# Altium project Power Board UCC28951.PrjPcb (part 2 of 4)

## Sheet 5V_Isolated_Bias.SchDoc
size B
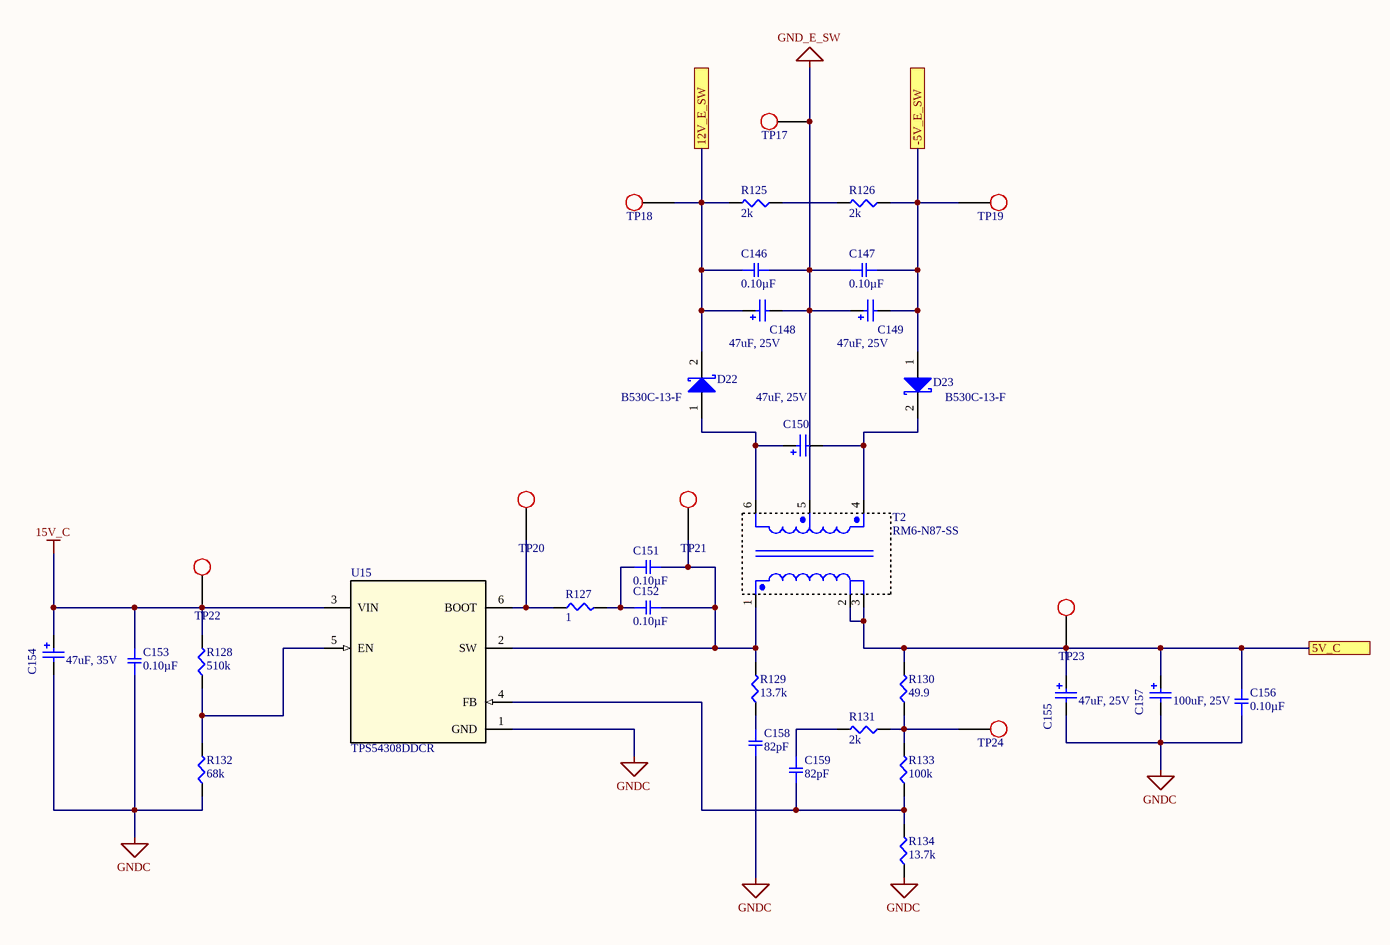
[diagram p7: 5V_Isolated_Bias.SchDoc]

### Parts
(Parts that share a designator on the sheet are numbered #1, #2 ... from top to bottom, then left to right.)
C146#1  0.10µF  [SMD-0603C]
C147#1  0.10µF  [SMD-0603C]
C148#1  47uF, 25V  [WCAP-ASLL_6.3x5.5]
C149#1  47uF, 25V  [WCAP-ASLL_6.3x5.5]
C150#1  47uF, 25V  [WCAP-ASLL_6.3x5.5]
C151#1  0.10µF  [SMD-0805C]
C152#1  0.10µF  [SMD-0805C]
C153#1  0.10µF  [SMD-0805C]
C154#1  47uF, 35V  [WCAP-ASLL_6.3x5.5]
C155  47uF, 25V  [WCAP-ASLL_6.3x5.5]
C156  0.10µF  [SMD-0603C]
C157  100uF, 25V  [WCAP-ASLU_8x6.5]
C158  82pF  [SMD-0805C]
C159  82pF  [SMD-0805C]
D22  B530C-13-F  [DIOD-SMC-2_V]
D23  B530C-13-F  [DIOD-SMC-2_V]
R125  2k  [SMD-0603-RES]
R126  2k  [SMD-0603-RES]
R127#1  1  [SMD-0603-RES]
R128#1  510k  [SMD-0603-RES]
R129#1  13.7k  [SMD-0603-RES]
R130#1  49.9  [SMD-0603-RES]
R131#1  2k  [SMD-0603-RES]
R132#1  68k  [SMD-0603-RES]
R133#1  100k  [SMD-0603-RES]
R134#1  13.7k  [SMD-0603-RES]
T2  RM6-N87-SS  [RM6-N87-SS]
TP17  Test Point  [Test_point_THT]  (value not drawn)  (no BOM)
TP18  Test Point  [Test_point_THT]  (value not drawn)  (no BOM)
TP19  Test Point  [Test_point_THT]  (value not drawn)  (no BOM)
TP20  Test Point  [Test_point_THT]  (value not drawn)  (no BOM)
TP21  Test Point  [Test_point_THT]  (value not drawn)  (no BOM)
TP22  Test Point  [Test_point_THT]  (value not drawn)  (no BOM)
TP23  Test Point  [Test_point_THT]  (value not drawn)  (no BOM)
TP24  Test Point  [Test_point_THT]  (value not drawn)  (no BOM)
U15#1  TPS54308DDCR  [SOT95P278X110-6N]

### Ports
5V_C, 12V_E_SW, -5V_E_SW

### Nets
5V_C: C155.2(P) C156.2 C157.2(P) R130#1.2 T2.2 T2.3 TP23.1 ; port 5V_C
12V_E_SW: C146#1.1 C148#1.2(P) D22.2(K) R125.2 TP18.1 ; port 12V_E_SW
15V_C: C153#1.2 C154#1.2(P) R128#1.2 TP22.1 U15#1.3(VIN)
-5V_E_SW: C147#1.2 C149#1.1(N) D23.1(A) R126.1 TP19.1 ; port -5V_E_SW
GND_E_SW: C146#1.2 C147#1.1 C148#1.1(N) C149#1.2(P) T2.5 TP17.1
GNDC: C153#1.1 C154#1.1(N) C155.1(N) C156.1 C157.1(N) C158.2 R132#1.1 R134#1.1 U15#1.1(GND)  [project net GND_LV]
NetC150#1_1: C150#1.1(N) D23.2(K) T2.4
NetC150#1_2: C150#1.2(P) D22.1(A) T2.6
NetC151#1_1: C151#1.1 C152#1.1 R127#1.2
NetC151#1_2: C151#1.2 C152#1.2 R129#1.2 T2.1 TP21.1 U15#1.2(SW)
NetC158_1: C158.1 R129#1.1
NetC159_1: C159.1 R131#1.2
NetC159_2: C159.2 R133#1.1 R134#1.2 U15#1.4(FB)
NetR125_1: R125.1 R126.2
NetR127#1_1: R127#1.1 TP20.1 U15#1.6(BOOT)
NetR128#1_1: R128#1.1 R132#1.2 U15#1.5(EN)
NetR130#1_1: R130#1.1 R131#1.1 R133#1.2 TP24.1

Not connected (* = marked no-connect by the designer): T2 8

### Library data of the parts
C146#1 C147#1 C156 = GCM188R71C104KA37D: CAP CER 0.1UF 16V X7R 0603; Manufacturer: Murata Electronics North America; Factory Stock: 0; Unit Price (USD): 0.18; Minimum Quantity: 1; Tolerance: ±10%; Datasheets: http://www.murata.com/~/media/webrenewal/support/library/catalog/products/capacitor/mlcc/c03e.ashx; Image: //media.digikey.com/Renders/Murata%20Renders/0603%28GCM188%29.jpg; Digi-Key Part Number: 490-4774-1-ND; Part Number: GCM188R71C104KA37D; Quantity Available: 284085; @ qty: 0; Packaging: Cut Tape (CT); Series: GCM; Part Status: Active; Value: 0.10µF; Voltage: 16V; Temperature Coefficient: X7R; Operating Temperature: -55°C ~ 125°C; Features: -; Ratings: AEC-Q200; Applications: Automotive; Mounting Type: Surface Mount, MLCC; Package / Case: 0603 (1608 Metric); Size / Dimension: 0.063" L x 0.031" W (1.60mm x 0.80mm); Height - Seated (Max): -; Thickness (Max): 0.035" (0.90mm); Lead Spacing: -; Lead Style: -
C148#1 C149#1 C150#1 C155 = 865060443004: WCAP-ASLL SMT Aluminum Electrolytic Capacitors, D6.3mm x L5.5mm, 47uF, +/-20%, 25VDC; Dissipation Factor: 14%; Endurance: 2000h; Leakage Current: 11.75uA; Ripple Current max.: 230mA; Technical Reference: ASED055470M025DVCTBB000; ComponentLink1Description: Manufacturer; ComponentLink1URL: http://www.we-online.de; ComponentLink2Description: Datasheet; ComponentLink2URL: https://katalog.we-online.com/pbs/datasheet/865060443004.pdf; Length: 5.5mm; Mounting Technology: SMT; Operating Temperature: -55 to +105degC; Packaging: Tape and Reel; Published Date: August 2019; Capacitance: 47uF; Diameter: 6.3mm; Part Number: 865060443004; Publisher: Wurth Elektronik; Capacitance Tolerance: +/-20%; Rated Voltage: 25VDC
C151#1 C152#1 C153#1 = GCD21BR71H104KA01L: CAP CER 0.1UF 50V X7R 0805; Manufacturer: Murata Electronics North America; Factory Stock: 0; Unit Price (USD): 0.24; Minimum Quantity: 1; Tolerance: ±10%; Datasheets: http://www.murata.com/~/media/webrenewal/support/library/catalog/products/capacitor/mlcc/c03e.ashx; Image: //media.digikey.com/Renders/Murata%20Renders/0805%28GxM6%29.jpg; Digi-Key Part Number: 490-11955-1-ND; Part Number: GCD21BR71H104KA01L; Quantity Available: 157; @ qty: 0; Packaging: Cut Tape (CT); Series: GCD; Part Status: Active; Value: 0.10µF; Voltage: 50V; Temperature Coefficient: X7R; Operating Temperature: -55°C ~ 125°C; Features: -; Ratings: AEC-Q200; Applications: Automotive; Mounting Type: Surface Mount, MLCC; Package / Case: 0805 (2012 Metric); Size / Dimension: 0.079" L x 0.049" W (2.00mm x 1.25mm); Height - Seated (Max): -; Thickness (Max): 0.049" (1.25mm); Lead Spacing: -; Lead Style: -
C154#1 = 865060543005: WCAP-ASLL SMT Aluminum Electrolytic Capacitors, D6.3mm x L5.5mm, 47uF, +/-20%, 35VDC; Dissipation Factor: 14%; Endurance: 2000h; Leakage Current: 16.45uA; Ripple Current max.: 240mA; Technical Reference: ASED055470M035DVCTBB000; ComponentLink1Description: Manufacturer; ComponentLink1URL: http://www.we-online.de; ComponentLink2Description: Datasheet; ComponentLink2URL: https://katalog.we-online.com/pbs/datasheet/865060543005.pdf; Length: 5.5mm; Mounting Technology: SMT; Operating Temperature: -55 to +105degC; Packaging: Tape and Reel; Published Date: August 2019; Capacitance: 47uF; Diameter: 6.3mm; Part Number: 865060543005; Publisher: Wurth Elektronik; Capacitance Tolerance: +/-20%; Rated Voltage: 35VDC
C157 = 865090449009: WCAP-ASLU Aluminium Electrolytic Capacitors, D8mm x L6.5mm, 100uF, +/-20%, 25VDC; Dissipation Factor: 16%; Leakage Current: 5uA; Endurance: 1000h; Technical Reference: ASBE065101M025DVCTBA000; Ripple Current max.: 110mA; ComponentLink1Description: Manufacturer; ComponentLink1URL: http://www.we-online.de; ComponentLink2Description: Datasheet; ComponentLink2URL: https://katalog.we-online.com/pbs/datasheet/865090449009.pdf; Mounting Technology: SMD; Operating Temperature: -40 to +85degC; Packaging: Tape and Reel; Part Number: 865090449009; Publisher: Wurth Elektronik; Capacitance: 100uF; Diameter: 8mm; Length: 6.5mm; Published Date: August 2019; Rated Voltage: 25VDC; Capacitance Tolerance: +/-20%
C158 C159 = GQM2195C1H820JB01D: CAP CER 82PF 50V NP0 0805; Manufacturer: Murata Electronics North America; Factory Stock: 0; Unit Price (USD): 1.22; Minimum Quantity: 1; Tolerance: ±5%; Temperature Coefficient: C0G, NP0; Datasheets: http://www.murata.com/~/media/webrenewal/support/library/catalog/products/capacitor/mlcc/c02e.pdf; Image: //media.digikey.com/Renders/Murata%20Renders/0805(GxM9).jpg; Digi-Key Part Number: 490-3615-1-ND; Part Number: GQM2195C1H820JB01D; Quantity Available: 7488; @ qty: 0; Packaging: Cut Tape (CT); Series: GQM; Part Status: Active; Value: 82pF; Voltage: 50V; Operating Temperature: -55°C ~ 125°C; Features: High Q, Low Loss; Ratings: -; Applications: RF, Microwave, High Frequency; Mounting Type: Surface Mount, MLCC; Package / Case: 0805 (2012 Metric); Size / Dimension: 0.079" L x 0.049" W (2.00mm x 1.25mm); Height - Seated (Max): -; Thickness (Max): 0.037" (0.95mm); Lead Spacing: -; Lead Style: -
D22 D23 = CMP-1693-00001-3: Surface Mount Schottky Barrier Rectifier, 5 A, 0.55 V, -55 to 150 degC, 2-Pin SMD, RoHS, Tape and Reel; Max Operating Temperature: 125 degC; ComponentLink2Description: Datasheet; PackageDescription: 2-Pin Surface Mount Device, Body 5.905 x 6.855 mm; Radiation Hardening: No; Mount: Surface Mount; Height: 2.3 mm; REACH SVHC: No SVHC; PartNumber: B530C-13-F; Packaging: Tape and Reel; Min Operating Temperature: -55 degC; Mounting Technology: Surface Mount; ComponentLink1URL: http://www.diodes.com/; ComponentLink1Description: Manufacturer URL; DatasheetVersion: Rev. 16-2; Length: 7.11 mm; ComponentLink2URL: http://www.diodes.com/_files/datasheets/ds13012.pdf; Package Quantity: 3000; Width: 6.22 mm; Case/Package: SMC; Pins: 2; RoHSCompliant: True
R125 R126 R131#1 = ERJ-3EKF2001V: RES SMD 2K OHM 1% 1/10W 0603; Manufacturer: Panasonic Electronic Components; Factory Stock: 0; Unit Price (USD): 0.00379; @ qty: 1500; Minimum Quantity: 1; Power (Watts): 0.1W, 1/10W; Temperature Coefficient: ±100ppm/°C; Part Number: ERJ-3EKF2001V; Datasheets: http://industrial.panasonic.com/www-cgi/jvcr13pz.cgi?E+PZ+3+AOA0002+ERJ3EKF2001V+7+WW; Image: //media.digikey.com/Photos/Panasonic%20Photos/MFG_ERJ-P6W%20Series.jpg; Digi-Key Part Number: P2.00KHCT-ND; Quantity Available: 1021544; Packaging: Cut Tape (CT); Series: ERJ; Part Status: Active; Value: 2k; Tolerance: ±1%; Composition: Thick Film; Features: Automotive AEC-Q200; Operating Temperature: -55°C ~ 155°C; Package / Case: 0603 (1608 Metric); Supplier Device Package: 0603; Size / Dimension: 0.063" L x 0.031" W (1.60mm x 0.80mm); Height - Seated (Max): 0.022" (0.55mm); Number of Terminations: 2; Failure Rate: -
R127#1 = ERJ-3BQF1R0V: RES SMD 1 OHM 1% 1/4W 0603; Manufacturer: Panasonic Electronic Components; Factory Stock: 0; Unit Price (USD): 0.05386; @ qty: 1500; Power (Watts): 0.25W, 1/4W; Temperature Coefficient: ±200ppm/°C; Part Number: ERJ-3BQF1R0V; Datasheets: https://industrial.panasonic.com/cdbs/www-data/pdf/RDA0000/AOA0000C239.pdf; Image: //media.digikey.com/Photos/Panasonic%20Photos/MFG_ERJ-P6W%20Series.jpg; Digi-Key Part Number: P17371CT-ND; Quantity Available: 30514; Minimum Quantity: 1; Packaging: Cut Tape (CT); Series: ERJ; Part Status: Active; Value: 1; Tolerance: ±1%; Composition: Thick Film; Features: Automotive AEC-Q200, Current Sense; Operating Temperature: -55°C ~ 125°C; Package / Case: 0603 (1608 Metric); Supplier Device Package: 0603; Size / Dimension: 0.063" L x 0.031" W (1.60mm x 0.80mm); Height - Seated (Max): 0.022" (0.55mm); Number of Terminations: 2; Failure Rate: -
R128#1 = ERJ-3EKF5103V: RES SMD 510K OHM 1% 1/10W 0603; Manufacturer: Panasonic Electronic Components; Factory Stock: 0; Unit Price (USD): 0.00379; @ qty: 1500; Minimum Quantity: 1; Power (Watts): 0.1W, 1/10W; Temperature Coefficient: ±100ppm/°C; Part Number: ERJ-3EKF5103V; Datasheets: http://industrial.panasonic.com/www-cgi/jvcr13pz.cgi?E+PZ+3+AOA0002+ERJ3EKF5103V+7+WW; Image: //media.digikey.com/Photos/Panasonic%20Photos/MFG_ERJ-P6W%20Series.jpg; Digi-Key Part Number: P510KHCT-ND; Quantity Available: 132059; Packaging: Cut Tape (CT); Series: ERJ; Part Status: Active; Value: 510k; Tolerance: ±1%; Composition: Thick Film; Features: Automotive AEC-Q200; Operating Temperature: -55°C ~ 155°C; Package / Case: 0603 (1608 Metric); Supplier Device Package: 0603; Size / Dimension: 0.063" L x 0.031" W (1.60mm x 0.80mm); Height - Seated (Max): 0.022" (0.55mm); Number of Terminations: 2; Failure Rate: -
R129#1 R134#1 = ERJ-3EKF1372V: RES SMD 13.7K OHM 1% 1/10W 0603; Manufacturer: Panasonic Electronic Components; Factory Stock: 0; Unit Price (USD): 0.00379; @ qty: 1500; Minimum Quantity: 1; Power (Watts): 0.1W, 1/10W; Temperature Coefficient: ±100ppm/°C; Part Number: ERJ-3EKF1372V; Datasheets: http://industrial.panasonic.com/www-cgi/jvcr13pz.cgi?E+PZ+3+AOA0002+ERJ3EKF1372V+7+WW; Image: //media.digikey.com/Photos/Panasonic%20Photos/MFG_ERJ-P6W%20Series.jpg; Digi-Key Part Number: P13.7KHCT-ND; Quantity Available: 81314; Packaging: Cut Tape (CT); Series: ERJ; Part Status: Active; Value: 13.7k; Tolerance: ±1%; Composition: Thick Film; Features: Automotive AEC-Q200; Operating Temperature: -55°C ~ 155°C; Package / Case: 0603 (1608 Metric); Supplier Device Package: 0603; Size / Dimension: 0.063" L x 0.031" W (1.60mm x 0.80mm); Height - Seated (Max): 0.022" (0.55mm); Number of Terminations: 2; Failure Rate: -
R130#1 = ERJ-3EKF49R9V: RES SMD 49.9 OHM 1% 1/10W 0603; Manufacturer: Panasonic Electronic Components; Factory Stock: 0; Unit Price (USD): 0.00379; @ qty: 1500; Minimum Quantity: 1; Power (Watts): 0.1W, 1/10W; Temperature Coefficient: ±100ppm/°C; Part Number: ERJ-3EKF49R9V; Datasheets: http://industrial.panasonic.com/www-cgi/jvcr13pz.cgi?E+PZ+3+AOA0002+ERJ3EKF49R9V+7+WW; Image: //media.digikey.com/Photos/Panasonic%20Photos/MFG_ERJ-P6W%20Series.jpg; Digi-Key Part Number: P49.9HCT-ND; Quantity Available: 566023; Packaging: Cut Tape (CT); Series: ERJ; Part Status: Active; Value: 49.9; Tolerance: ±1%; Composition: Thick Film; Features: Automotive AEC-Q200; Operating Temperature: -55°C ~ 155°C; Package / Case: 0603 (1608 Metric); Supplier Device Package: 0603; Size / Dimension: 0.063" L x 0.031" W (1.60mm x 0.80mm); Height - Seated (Max): 0.022" (0.55mm); Number of Terminations: 2; Failure Rate: -
R132#1 = ERJ-3EKF6802V: RES SMD 68K OHM 1% 1/10W 0603; Manufacturer: Panasonic Electronic Components; Factory Stock: 0; Unit Price (USD): 0.00379; @ qty: 1500; Minimum Quantity: 1; Power (Watts): 0.1W, 1/10W; Temperature Coefficient: ±100ppm/°C; Part Number: ERJ-3EKF6802V; Datasheets: http://industrial.panasonic.com/www-cgi/jvcr13pz.cgi?E+PZ+3+AOA0002+ERJ3EKF6802V+7+WW; Image: //media.digikey.com/Photos/Panasonic%20Photos/MFG_ERJ-P6W%20Series.jpg; Digi-Key Part Number: P68.0KHCT-ND; Quantity Available: 63788; Packaging: Cut Tape (CT); Series: ERJ; Part Status: Active; Value: 68k; Tolerance: ±1%; Composition: Thick Film; Features: Automotive AEC-Q200; Operating Temperature: -55°C ~ 155°C; Package / Case: 0603 (1608 Metric); Supplier Device Package: 0603; Size / Dimension: 0.063" L x 0.031" W (1.60mm x 0.80mm); Height - Seated (Max): 0.022" (0.55mm); Number of Terminations: 2; Failure Rate: -
R133#1 = ERJ-3GEYJ104V: RES SMD 100K OHM 5% 1/10W 0603; Manufacturer: Panasonic Electronic Components; Factory Stock: 0; Unit Price (USD): 0.00321; @ qty: 1500; Minimum Quantity: 1; Power (Watts): 0.1W, 1/10W; Temperature Coefficient: ±200ppm/°C; Part Number: ERJ-3GEYJ104V; Datasheets: http://industrial.panasonic.com/www-cgi/jvcr13pz.cgi?E+PZ+3+AOA0001+ERJ3GEYJ104V+7+WW; Image: //media.digikey.com/Photos/Panasonic%20Photos/MFG_ERJ-P6W%20Series.jpg; Digi-Key Part Number: P100KGCT-ND; Quantity Available: 1377078; Packaging: Cut Tape (CT); Series: ERJ; Part Status: Active; Value: 100k; Tolerance: ±5%; Composition: Thick Film; Features: Automotive AEC-Q200; Operating Temperature: -55°C ~ 155°C; Package / Case: 0603 (1608 Metric); Supplier Device Package: 0603; Size / Dimension: 0.063" L x 0.031" W (1.60mm x 0.80mm); Height - Seated (Max): 0.022" (0.55mm); Number of Terminations: 2; Failure Rate: -
TP17-TP24 = Test Point: TP
U15#1 = TPS54308DDCR: Imported; Manufacturer: Texas Instruments; PartNumber: TPS54308DDCR; RefDes: RefDes; Type: DEV; Value: Value; Manufacturer_Part_Number: TPS54308DDCR; Manufacturer_Name: Texas Instruments

## Sheet EMI Stage Break Out.SchDoc
size A4
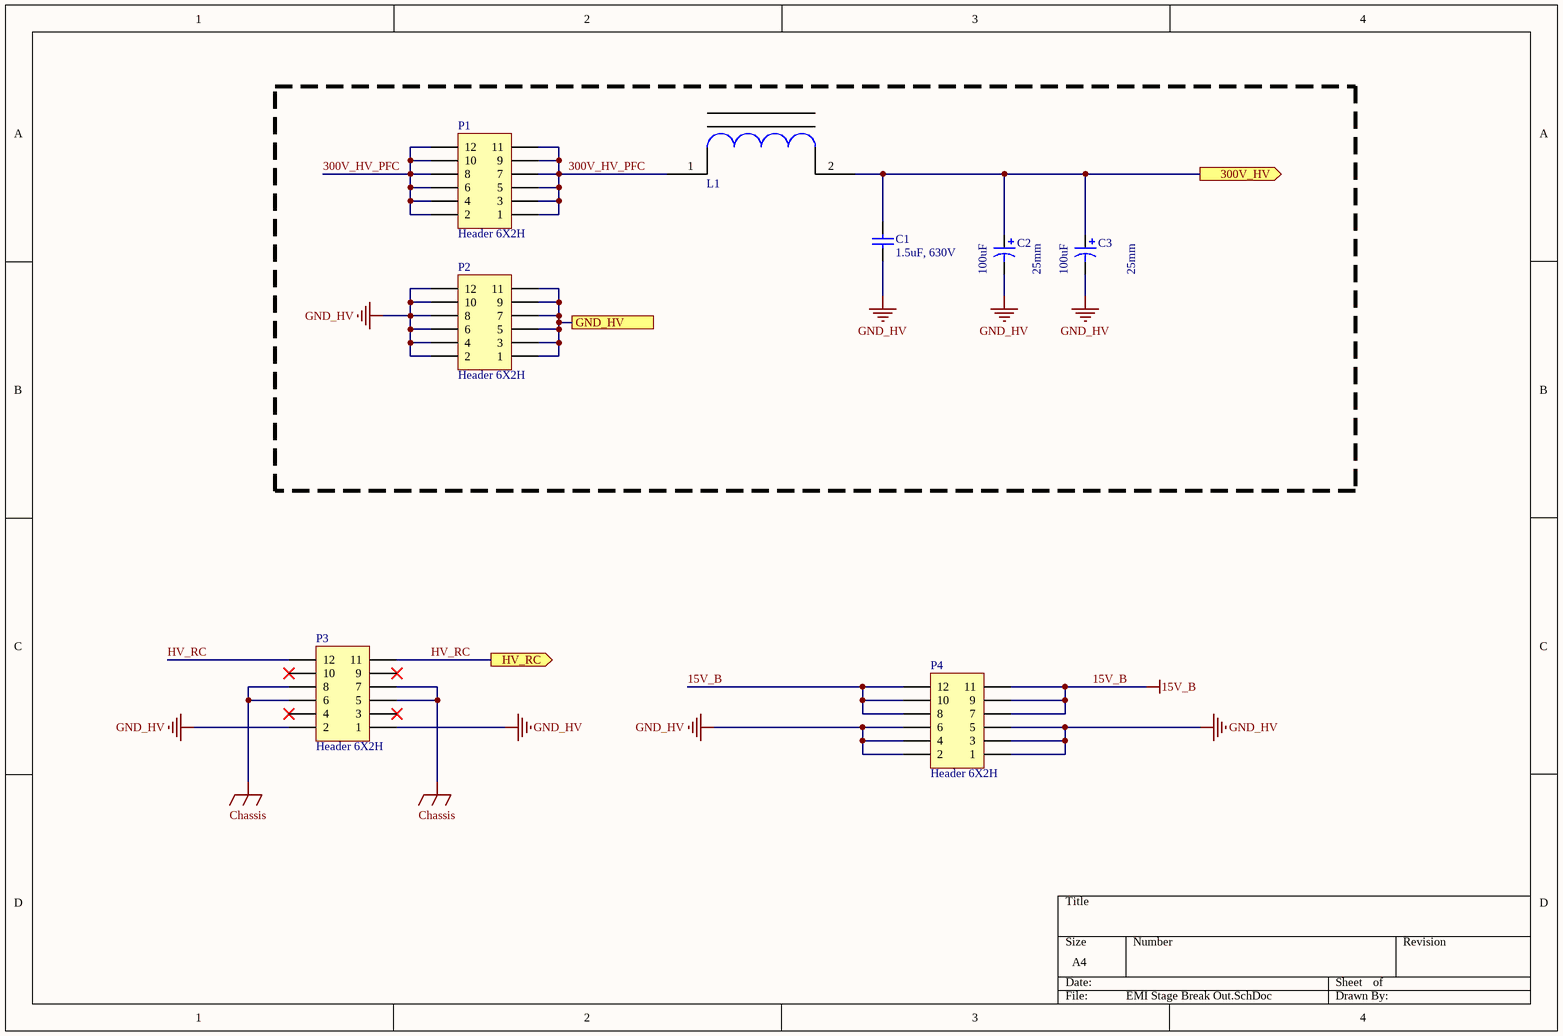
[diagram p8: EMI Stage Break Out.SchDoc]

### Parts
C1  1.5uF, 630V  [L31_W15_H24.5_P27.5]
C2  25mm  value 100uF  [450V_25mm_Dia_10mm_pitch - Black]
C3  25mm  value 100uF  [450V_25mm_Dia_10mm_pitch - Black]
L1  Transformer_Inductor  [Shim Inductor]  (value not drawn)
P1  Header 6X2H  [Stackable-Conn]
P2  Header 6X2H  [Stackable-Conn]
P3  Header 6X2H  [Stackable-Conn]
P4  Header 6X2H  [Stackable-Conn]

### Ports
300V_HV (out), GND_HV, HV_RC (out)

### Nets
15V_B: P4.7 P4.8 P4.9 P4.10 P4.11 P4.12
Chassis: P3.5 P3.6 P3.7 P3.8
GND_HV: C1.1 C2.2 C3.2 P2.1 P2.2 P2.3 P2.4 P2.5 P2.6 P2.7 P2.8 P2.9 P2.10 P2.11 P2.12 P3.1 P3.2 P4.1 P4.2 P4.3 P4.4 P4.5 P4.6 ; port GND_HV
300V_HV: C1.2 C2.1 C3.1 L1.2 ; port 300V_HV
300V_HV_PFC: L1.1 P1.1 P1.2 P1.3 P1.4 P1.5 P1.6 P1.7 P1.8 P1.9 P1.10 P1.11 P1.12
HV_RC: P3.11 P3.12 ; port HV_RC

Not connected (* = marked no-connect by the designer): P3 3* 4* 9* 10*

### Library data of the parts
C1 = 890303427009CS: WCAP-FTBE THT Film Capacitors, 1.5uF, 630VDC; Insulation Resistance: 3000Ohm x F; Dissipation Factor@100kHz: 5.2%; Dissipation Factor@1kHz: 1%; Dissipation Factor@10kHz: 1.6%; Pitch: 27.5mm; Rate of Voltage Rise: 17V/us; Technical Reference: MPSP275155K630DCPP25004; ComponentLink1Description: Manufacturer; ComponentLink1URL: http://www.we-online.de; ComponentLink2Description: Datasheet; ComponentLink2URL: https://katalog.we-online.com/pbs/datasheet/890303427009CS.pdf; Length: 31mm; Mounting Technology: THT; Packaging: Carton; Part Number: 890303427009CS; Operating Temperature: -40 to +85degC; Width: 15mm; Capacitance: 1.5uF; Height: 24.5mm; Rated Voltage: 630VDC; Publisher: Wurth Elektronik; Published Date: August 2019
C2 C3 = Cap Pol1: Polarized Capacitor (Radial); Published: 8-Jun-2000; LatestRevisionDate: 17-Jul-2002; LatestRevisionNote: Re-released for DXP Platform.; PackageReference: RB7.6-15; Publisher: Altium Limited; PackageDescription: Polarized Capacitor (Radial); 2 Leads
P1-P4 = Header 6X2H: Header, 6-Pin, Dual row, Right Angle; LatestRevisionDate: 17-Jul-2002; LatestRevisionNote: Re-released for DXP Platform.; Publisher: Altium Limited

## Sheet Thermal Sense Network.SchDoc
size C
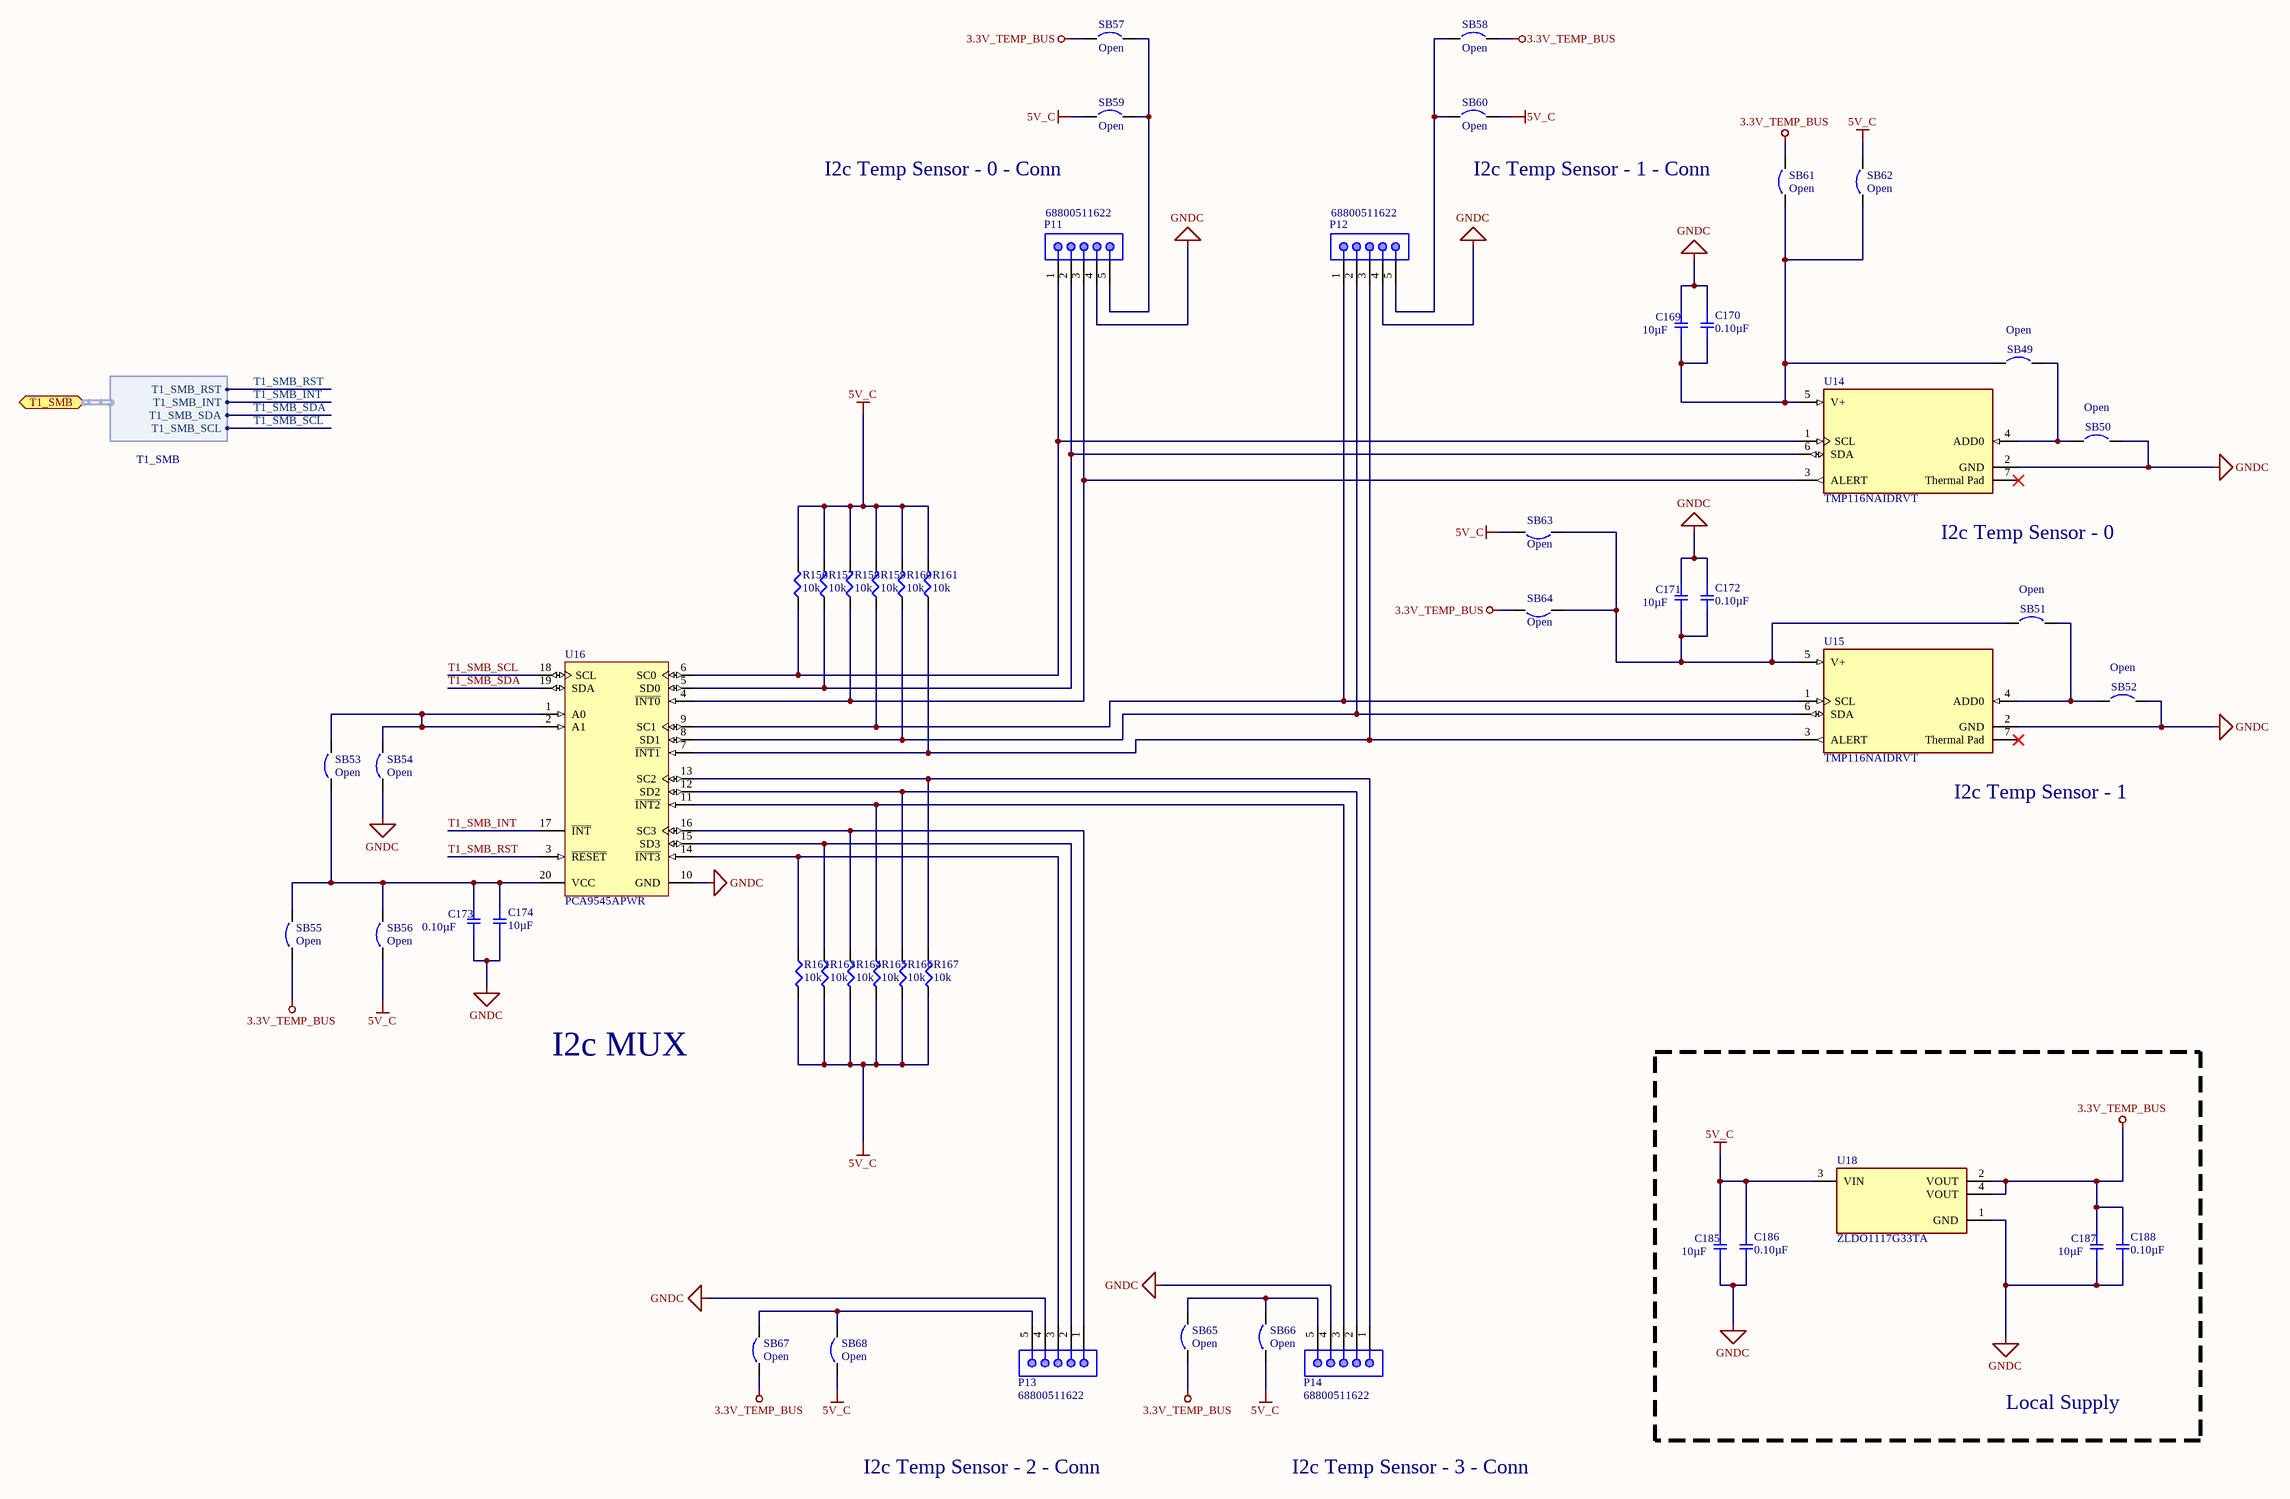
[diagram p9: Thermal Sense Network.SchDoc]

### Parts
(Parts that share a designator on the sheet are numbered #1, #2 ... from top to bottom, then left to right.)
C169  10µF  [SMD-0805C]
C170#1  0.10µF  [SMD-0805C]
C171#1  10µF  [SMD-0805C]
C172#1  0.10µF  [SMD-0805C]
C173#1  0.10µF  [SMD-0805C]
C174#1  10µF  [SMD-0805C]
C185  10µF  [SMD-0805C]
C186  0.10µF  [SMD-0805C]
C187  10µF  [SMD-0805C]
C188  0.10µF  [SMD-0805C]
P11  68800511622  [68800511622]
P12#2  68800511622  [68800511622]
P13#2  68800511622  [68800511622]
P14#1  68800511622  [68800511622]
R156#1  10k  [SMD-0603-RES]
R157#1  10k  [SMD-0603-RES]
R158#1  10k  [SMD-0603-RES]
R159#1  10k  [SMD-0603-RES]
R160#1  10k  [SMD-0603-RES]
R161#1  10k  [SMD-0603-RES]
R162#1  10k  [SMD-0603-RES]
R163#1  10k  [SMD-0603-RES]
R164  10k  [SMD-0603-RES]
R165  10k  [SMD-0603-RES]
R166  10k  [SMD-0603-RES]
R167  10k  [SMD-0603-RES]
SB49  Open  [SB_0603]  (no BOM)
SB50  Open  [SB_0603]  (no BOM)
SB51  Open  [SB_0603]  (no BOM)
SB52  Open  [SB_0603]  (no BOM)
SB53  Open  [SB_0603]  (no BOM)
SB54  Open  [SB_0603]  (no BOM)
SB55  Open  [SB_0603]  (no BOM)
SB56  Open  [SB_0603]  (no BOM)
SB57  Open  [1206 - Solder Bridge]  (no BOM)
SB58  Open  [1206 - Solder Bridge]  (no BOM)
SB59  Open  [1206 - Solder Bridge]  (no BOM)
SB60  Open  [1206 - Solder Bridge]  (no BOM)
SB61  Open  [0805-Solder Bridge]  (no BOM)
SB62  Open  [0805-Solder Bridge]  (no BOM)
SB63  Open  [0805-Solder Bridge]  (no BOM)
SB64  Open  [0805-Solder Bridge]  (no BOM)
SB65  Open  [1206 - Solder Bridge]  (no BOM)
SB66#1  Open  [1206 - Solder Bridge]  (no BOM)
SB67#1  Open  [1206 - Solder Bridge]  (no BOM)
SB68#1  Open  [1206 - Solder Bridge]  (no BOM)
U14#1  TMP116NAIDRVT  [FP-DRV0006A-MFG]
U15#2  TMP116NAIDRVT  [FP-DRV0006A-MFG]
U16  PCA9545APWR  [QFN50P350X450X80_HS-21N]
U18  ZLDO1117G33TA  [FP-SOT223-MFG]

### Blocks framed on the sheet
Local Supply: C185-C188 U18

### Ports
T1_SMB (bidir, harness T1_SMB)

### Harnesses
T1_SMB: T1_SMB_SCL, T1_SMB_SDA, T1_SMB_INT, T1_SMB_RST

### Nets
3.3V_TEMP_BUS: C187.1 C188.1 SB55.1 SB57.1 SB58.1 SB61.1 SB64.1 SB65.1 SB67#1.1 U18.2(VOUT) U18.4(VOUT)
5V_C: C185.1 C186.1 R156#1.2 R157#1.2 R158#1.2 R159#1.2 R160#1.2 R161#1.2 R162#1.2 R163#1.2 R164.2 R165.2 R166.2 R167.2 SB56.1 SB59.1 SB60.1 SB62.1 SB63.1 SB66#1.1 SB68#1.1 U18.3(VIN)
GNDC: C169.1 C170#1.1 C171#1.1 C172#1.1 C173#1.1 C174#1.1 C185.2 C186.2 C187.2 C188.2 P11.4 P12#2.4 P13#2.4 P14#1.4 SB50.2 SB52.2 SB54.1 U14#1.2(GND) U15#2.2(GND) U16.10(GND) U18.1(GND)  [project net GND_LV]
T1_SMB_INT: U16.17(~{INT}) ; port T1_SMB.T1_SMB_INT
T1_SMB_RST: U16.3(~{RESET}) ; port T1_SMB.T1_SMB_RST
T1_SMB_SCL: U16.18(SCL) ; port T1_SMB.T1_SMB_SCL
T1_SMB_SDA: U16.19(SDA) ; port T1_SMB.T1_SMB_SDA
NetC169_2: C169.2 C170#1.2 SB49.1 SB61.2 SB62.2 U14#1.5(V+)
NetC171#1_2: C171#1.2 C172#1.2 SB51.1 SB63.2 SB64.2 U15#2.5(V+)
NetC173#1_2: C173#1.2 C174#1.2 SB53.1 SB55.2 SB56.2 U16.20(VCC)
NetP11_1: P11.1 R156#1.1 U14#1.1(SCL) U16.6(SC0)
NetP11_2: P11.2 R157#1.1 U14#1.6(SDA) U16.5(SD0)
NetP11_3: P11.3 R158#1.1 U14#1.3(ALERT) U16.4(~{INT0})
NetP11_5: P11.5 SB57.2 SB59.2
NetP12#2_1: P12#2.1 R159#1.1 U15#2.1(SCL) U16.9(SC1)
NetP12#2_2: P12#2.2 R160#1.1 U15#2.6(SDA) U16.8(SD1)
NetP12#2_3: P12#2.3 R161#1.1 U15#2.3(ALERT) U16.7(~{INT1})
NetP12#2_5: P12#2.5 SB58.2 SB60.2
NetP13#2_1: P13#2.1 R164.1 U16.16(SC3)
NetP13#2_2: P13#2.2 R163#1.1 U16.15(SD3)
NetP13#2_3: P13#2.3 R162#1.1 U16.14(~{INT3})
NetP13#2_5: P13#2.5 SB67#1.2 SB68#1.2
NetP14#1_1: P14#1.1 R167.1 U16.13(SC2)
NetP14#1_2: P14#1.2 R166.1 U16.12(SD2)
NetP14#1_3: P14#1.3 R165.1 U16.11(~{INT2})
NetP14#1_5: P14#1.5 SB65.2 SB66#1.2
NetSB49_2: SB49.2 SB50.1 U14#1.4(ADD0)
NetSB51_2: SB51.2 SB52.1 U15#2.4(ADD0)
NetSB53_2: SB53.2 SB54.2 U16.1(A0) U16.2(A1)

Not connected (* = marked no-connect by the designer): U14#1 7(Thermal_Pad)*; U15#2 7(Thermal_Pad)*

### Notes on the sheet
- (near SB59) I2c Temp Sensor - 0 - Conn
- I2c Temp Sensor - 1 - Conn
- (near U14#1) I2c Temp Sensor - 0
- (near U15#2) I2c Temp Sensor - 1
- I2c MUX
- I2c Temp Sensor - 2 - Conn
- I2c Temp Sensor - 3 - Conn

### Library data of the parts
C169 C171#1 C174#1 C185 C187 = GRM21BC71E106ME11L: CAP CER 10UF 25V X7S 0805; Manufacturer: Murata Electronics North America; Factory Stock: 0; Unit Price (USD): 0.57; Minimum Quantity: 1; Tolerance: ±20%; Datasheets: http://www.murata.com/~/media/webrenewal/support/library/catalog/products/capacitor/mlcc/c02e.pdf; Image: //media.digikey.com/Renders/Murata%20Renders/0805%20(2012%20Metric)%20.85mm.jpg; Digi-Key Part Number: 490-10497-1-ND; Part Number: GRM21BC71E106ME11L; Quantity Available: 8540; @ qty: 0; Packaging: Cut Tape (CT); Series: GRM; Part Status: Active; Value: 10µF; Voltage: 25V; Temperature Coefficient: X7S; Operating Temperature: -55°C ~ 125°C; Features: Derating Recommended; Ratings: -; Applications: General Purpose; Mounting Type: Surface Mount, MLCC; Package / Case: 0805 (2012 Metric); Size / Dimension: 0.079" L x 0.049" W (2.00mm x 1.25mm); Height - Seated (Max): -; Thickness (Max): 0.057" (1.45mm); Lead Spacing: -; Lead Style: -
C170#1 C172#1 C173#1 C186 C188 = GCD21BR71H104KA01L: as C151#1 on sheet 5V_Isolated_Bias; Datasheets: http://www.murata.com/~/media/webrenewal/support/library/catalog/products/capacitor/mlcc/c03e.ashx; Image: //media.digikey.com/Renders/Murata%20Renders/0805%28GxM6%29.jpg; Digi-Key Part Number: 490-11955-1-ND; Part Number: GCD21BR71H104KA01L; Quantity Available: 157; @ qty: 0; Packaging: Cut Tape (CT); Series: GCD; Part Status: Active; Value: 0.10µF; Voltage: 50V; Temperature Coefficient: X7R; Operating Temperature: -55°C ~ 125°C; Features: -; Ratings: AEC-Q200; Applications: Automotive; Mounting Type: Surface Mount, MLCC; Package / Case: 0805 (2012 Metric); Size / Dimension: 0.079" L x 0.049" W (2.00mm x 1.25mm); Height - Seated (Max): -; Thickness (Max): 0.049" (1.25mm); Lead Spacing: -; Lead Style: -
P11 P12#2 P13#2 P14#1 = 68800511622: WR-WTB “J” Type THT Vertical Male Shrouded Header, pitch 2.5mm, 5p; Pin Number: 5; Contact Resistance: 20mOhm; Rated Current: 3A; Withstanding Voltage: 800VAC; Working Voltage: 250VAC; ComponentLink1Description: Manufacturer; ComponentLink1URL: http://www.we-online.de; ComponentLink2Description: Datasheet; ComponentLink2URL: https://www.we-online.com/catalog/datasheet/68800511622.pdf; Pitch: 2.5mm; Published Date: January 2020; Publisher: Wurth Elektronik; Mounting Technology: THT; Packaging: Bag; Operating Temperature: -25 to +85degC; Part Number: 68800511622; Gender: Male; Type: Vertical
R156#1 R157#1 R158#1 R159#1 R160#1 R161#1 R162#1 R163#1 R164-R167 = ERJ-3GEYJ103V: RES SMD 10K OHM 5% 1/10W 0603; Manufacturer: Panasonic Electronic Components; Factory Stock: 0; Unit Price (USD): 0.00321; @ qty: 1500; Minimum Quantity: 1; Power (Watts): 0.1W, 1/10W; Temperature Coefficient: ±200ppm/°C; Part Number: ERJ-3GEYJ103V; Datasheets: http://industrial.panasonic.com/www-cgi/jvcr13pz.cgi?E+PZ+3+AOA0001+ERJ3GEYJ103V+7+WW; Image: //media.digikey.com/Photos/Panasonic%20Photos/MFG_ERJ-P6W%20Series.jpg; Digi-Key Part Number: P10KGCT-ND; Quantity Available: 7178118; Packaging: Cut Tape (CT); Series: ERJ; Part Status: Active; Value: 10k; Tolerance: ±5%; Composition: Thick Film; Features: Automotive AEC-Q200; Operating Temperature: -55°C ~ 155°C; Package / Case: 0603 (1608 Metric); Supplier Device Package: 0603; Size / Dimension: 0.063" L x 0.031" W (1.60mm x 0.80mm); Height - Seated (Max): 0.022" (0.55mm); Number of Terminations: 2; Failure Rate: -
SB49-SB65 SB66#1 SB67#1 SB68#1 = Solder Bridge: Circuit Breaker; Published: 24-Mar-1999; Revision: July-2002: Re-released for DXP Platform.; Publisher: Altium Limited
U14#1 U15#2 = CMP-04948-000020-1: SENSOR DIGITAL -55C-125C 6WSON; Manufacturer: Texas Instruments; Max Supply Voltage: 5.5V; Min Supply Voltage: 1.9V; Standoff Height: 0mm; Accuracy: 0.2%; Operating Supply Current: 3.5-135uA; Max Junction Temp: +150°C; Interface: I2C,SMBus; Resolution: 16bits; Temperature Range High: +125°C; Device Class L1: Sensors; Package: DRV0006A; Temperature Range Low: -55°C; Lead Free: Yes; Digikey Description: SENSOR DIGITAL -55C-125C 6WSON; RoHS: TRUE; Height: 0.8mm; Ambient Temperature Range High: +150°C; Temperature: -55°C to +125°C; ComponentLink2Description: Datasheet; Device Class L3: unset; Ambient Temperature Range Low: -55°C; Category: IC; Octopart: https://octopart.com/tmp116naidrvt-texas+instruments-82367759; Device Class L2: Temperature and Humidity Sensors; Manufacturer Part Number: TMP116NAIDRVT; ComponentLink2URL: http://www.ti.com/lit/ds/symlink/tmp116.pdf; Automotive: No
U16 = CMP-0314-00327-2: 4-Channel I2C and SMBus Multiplexer with Interrupt Logic and Reset Functions, 2.3 to 5.5 V, -40 to 85 degC, 20-pin TSSOP (PW), Green (RoHS & no Sb/Br); Manufacturer: Texas Instruments; Max Frequency(kHz): 400; Interrupt Output: Yes; Channel Width: 4; VCC(Max)(V): 5.5; Simultaneously Active Channels: 1 to 4; VCC(Min)(V): 2.3; tpd max(ns): 1; SubFamily: I2C Multiplexer, Switch; I2C Address: 1110 0xx; fSCLK(Max)(MHz): 400; Code_JEDEC: MO-153; 5V Tolerant I/O: Yes; Vcc range(V): 2.3 to 5.5; PackageReference: PW0020A; Mounting Technology: Surface Mount; Open Drain I/O Type: Yes; ComponentLink1URL: http://www.ti.com/general/docs/lit/getliterature.tsp?genericPartNumber=PCA9545A&fileType=pdf; ComponentLink1Description: Datasheet; PackageVersion: revG, Feb-2011; DatasheetVersion: SCPS147C; PartNumber: PCA9545APWR; Eco-Plan: Green (RoHS & no Sb/Br); Reset Input: Yes; PackageDescription: 20-Pin Plastic Thin Small Outline Package 6.5 x 4.4 mm Body ,0.65 mm Pitch
U18 = CMP-12756-000030-1: IC REG LINEAR 3.3V 1A SOT223-3; Dropout Voltage: 1.11V; Power Dissipation: 15W; Output Voltage Accuracy: 2%; Max Input Voltage: 18V; Output Type: Fixed; Number of Regulators: 1; Min Input Voltage: 2.7V; Min Current Limit: 1.1A; Quiescent Current: 10mA; Polarity: Positive; Length: 6.7mm; Min Operating Temperature: -40°C; Max Output Current: 1A; Min Output Voltage: 3.3V; Width: 3.7mm; Reference Voltage: 3.3V; Number of Pins: 3; Package Quantity: 1000; Tolerance: 2%; Max Operating Temperature: 125°C; Output Voltage: 3.3V; Accuracy: 2%; Case/Package: SOT-223; Lead Free: Lead Free; Radiation Hardening: No; Output Current: 1A; Number of Outputs: 1; Packaging: Tape and Reel; REACH SVHC: No SVHC; Max Power Dissipation: 15W; Height: 1.7mm; Mount: Surface Mount; Weight: 0.000282oz; Nominal Output Voltage: 3.3V

## Sheet Output Sense Network.SchDoc
size A4
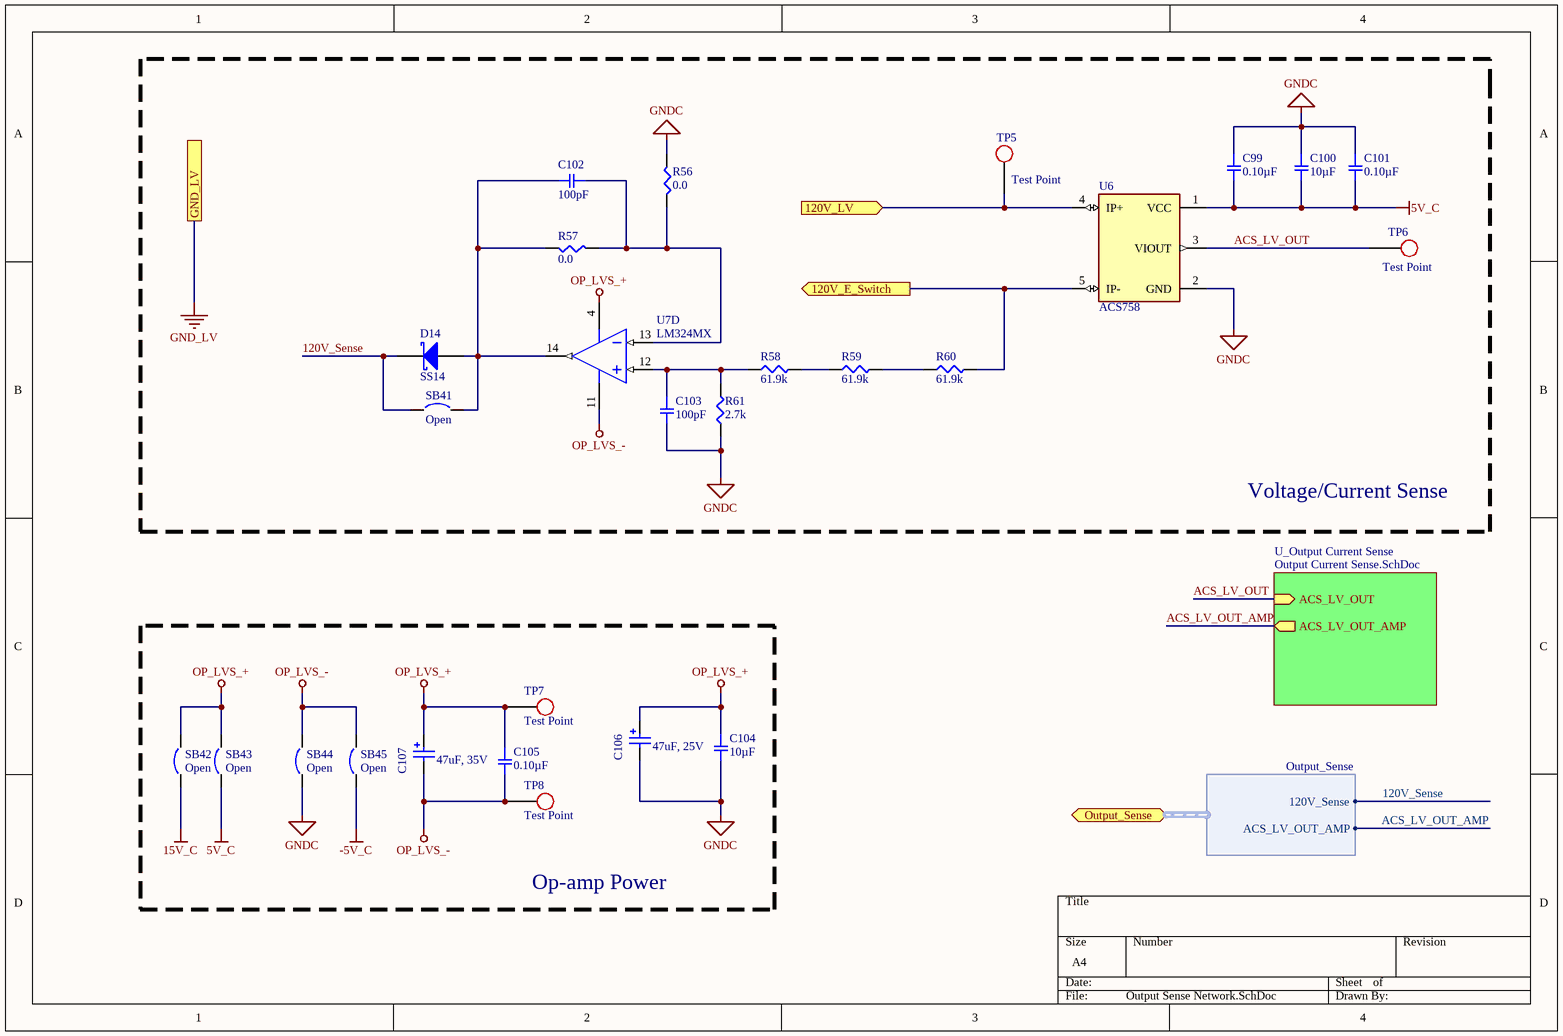
[diagram p10: Output Sense Network.SchDoc]

### Parts
(Parts that share a designator on the sheet are numbered #1, #2 ... from top to bottom, then left to right.)
C99  0.10µF  [SMD-0805C]
C100  10µF  [SMD-0805C]
C101  0.10µF  [SMD-0805C]
C102  100pF  [SMD-0603C]
C103#1  100pF  [SMD-0603C]
C104#1  10µF  [SMD-0805C]
C105#1  0.10µF  [SMD-0805C]
C106#1  47uF, 25V  [WCAP-ASLU_6.3x7.7]
C107#1  47uF, 35V  [WCAP-ASLL_6.3x5.5]
D14  SS14  [DIOM4226X22N]
R56  0.0  [SMD-0603-RES]
R57  0.0  [SMD-0603-RES]
R58  61.9k  [SMD-2512-RES]
R59  61.9k  [SMD-2512-RES]
R60  61.9k  [SMD-2512-RES]
R61  2.7k  [SMD-1206-RES]
SB41  Open  [0805-Solder Bridge]  (no BOM)
SB42  Open  [0805-Solder Bridge]  (no BOM)
SB43  Open  [0805-Solder Bridge]  (no BOM)
SB44  Open  [0805-Solder Bridge]  (no BOM)
SB45#1  Open  [0805-Solder Bridge]  (no BOM)
TP5  Test Point  [Test_point_SMD]  (no BOM)
TP6  Test Point  [Test_point_SMD]  (no BOM)
TP7  Test Point  [Test_point_SMD]  (no BOM)
TP8  Test Point  [Test_point_SMD]  (no BOM)
U6  ACS758  [XDCR_ACS758]
U7  LM324MX  [D0014A_L]  (part D of 4)

### Blocks framed on the sheet
Voltage/Current Sense: C99-C102 C103#1 D14 R56-R61 SB41 TP5 TP6 U6 U7
Op-amp Power: C104#1 C105#1 C106#1 C107#1 SB42-SB44 SB45#1 TP7 TP8

### Sub-sheets
U_Output Current Sense = Output Current Sense.SchDoc: ACS_LV_OUT (in), ACS_LV_OUT_AMP (out)

### Ports
120V_E_Switch (out), 120V_LV (in), GND_LV, Output_Sense (bidir, harness Output_Sense)

### Harnesses
Output_Sense: 120V_Sense, ACS_LV_OUT_AMP

### Nets
5V_C: C99.2 C100.2 C101.2 SB43.1 U6.1(VCC)
15V_C: SB42.1
-5V_C: SB45#1.1
GND_LV: C99.1 C100.1 C101.1 C103#1.2 C104#1.2 C106#1.1(N) R56.2 R61.1 SB44.1 U6.2(GND) ; port GND_LV  [also labelled GNDC]
OP_LVS_+: C104#1.1 C105#1.1 C106#1.2(P) C107#1.2(P) SB42.2 SB43.2 TP7.1 U7.4(V+)
OP_LVS_-: C105#1.2 C107#1.1(N) SB44.2 SB45#1.2 TP8.1 U7.11(GND)
120V_LV: TP5.1 U6.4(IP+) ; port 120V_LV
120V_Sense: D14.1(K) SB41.1 ; port Output_Sense.120V_Sense
ACS_LV_OUT: TP6.1 U6.3(VIOUT) ; sheet U_Output Current Sense/ACS_LV_OUT
ACS_LV_OUT_AMP: sheet U_Output Current Sense/ACS_LV_OUT_AMP, port Output_Sense.ACS_LV_OUT_AMP
E_SW_Clamp: R60.2 U6.5(IP-) ; port 120V_E_Switch
NetC102_1: C102.1 R56.1 R57.2 U7.13(IN4-)
NetC102_2: C102.2 D14.2(A) R57.1 SB41.2 U7.14(OUT4)
NetC103#1_1: C103#1.1 R58.1 R61.2 U7.12(IN4+)
NetR58_2: R58.2 R59.1
NetR59_2: R59.2 R60.1

### Library data of the parts
C99 C101 C105#1 = GCD21BR71H104KA01L: as C151#1 on sheet 5V_Isolated_Bias; Datasheets: http://www.murata.com/~/media/webrenewal/support/library/catalog/products/capacitor/mlcc/c03e.ashx; Image: //media.digikey.com/Renders/Murata%20Renders/0805%28GxM6%29.jpg; Digi-Key Part Number: 490-11955-1-ND; Part Number: GCD21BR71H104KA01L; Quantity Available: 157; @ qty: 0; Packaging: Cut Tape (CT); Series: GCD; Part Status: Active; Value: 0.10µF; Voltage: 50V; Temperature Coefficient: X7R; Operating Temperature: -55°C ~ 125°C; Features: -; Ratings: AEC-Q200; Applications: Automotive; Mounting Type: Surface Mount, MLCC; Package / Case: 0805 (2012 Metric); Size / Dimension: 0.079" L x 0.049" W (2.00mm x 1.25mm); Height - Seated (Max): -; Thickness (Max): 0.049" (1.25mm); Lead Spacing: -; Lead Style: -
C100 C104#1 = GCJ21BR71A106KE01L: CAP CER 10UF 10V X7R 0805; Manufacturer: Murata Electronics North America; Factory Stock: 0; Unit Price (USD): 0.56; Minimum Quantity: 1; Tolerance: ±10%; Datasheets: http://www.murata.com/~/media/webrenewal/support/library/catalog/products/capacitor/mlcc/c03e.ashx; Image: //media.digikey.com/Renders/Murata%20Renders/0805%20(2012%20Metric)%20.85mm.jpg; Digi-Key Part Number: 490-12646-1-ND; Part Number: GCJ21BR71A106KE01L; Quantity Available: 2702; @ qty: 0; Packaging: Cut Tape (CT); Series: GCJ; Part Status: Active; Value: 10µF; Voltage: 10V; Temperature Coefficient: X7R; Operating Temperature: -55°C ~ 125°C; Features: Soft Termination; Ratings: AEC-Q200; Applications: Automotive, Boardflex Sensitive; Mounting Type: Surface Mount, MLCC; Package / Case: 0805 (2012 Metric); Size / Dimension: 0.079" L x 0.049" W (2.00mm x 1.25mm); Height - Seated (Max): -; Thickness (Max): 0.057" (1.45mm); Lead Spacing: -; Lead Style: -
C102 C103#1 = GCM1885C1H101JA16D: CAP CER 100PF 50V NP0 0603; Manufacturer: Murata Electronics North America; Factory Stock: 0; Unit Price (USD): 0.1; Minimum Quantity: 1; Tolerance: ±5%; Temperature Coefficient: C0G, NP0; Datasheets: http://www.murata.com/~/media/webrenewal/support/library/catalog/products/capacitor/mlcc/c03e.ashx; Image: //media.digikey.com/Renders/Murata%20Renders/0603%28GCM188%29.jpg; Digi-Key Part Number: 490-4767-1-ND; Part Number: GCM1885C1H101JA16D; Quantity Available: 85695; @ qty: 0; Packaging: Cut Tape (CT); Series: GCM; Part Status: Active; Value: 100pF; Voltage: 50V; Operating Temperature: -55°C ~ 125°C; Features: -; Ratings: AEC-Q200; Applications: Automotive; Mounting Type: Surface Mount, MLCC; Package / Case: 0603 (1608 Metric); Size / Dimension: 0.063" L x 0.031" W (1.60mm x 0.80mm); Height - Seated (Max): -; Thickness (Max): 0.035" (0.90mm); Lead Spacing: -; Lead Style: -
C106#1 = 865090445006: WCAP-ASLU Aluminium Electrolytic Capacitors, D6.3mm x L7.7mm, 47uF, +/-20%, 25VDC; Dissipation Factor: 16%; Leakage Current: 2.35uA; Endurance: 1000h; Technical Reference: ASBD077470M025DVCTCA000; Ripple Current max.: 65mA; ComponentLink1Description: Manufacturer; ComponentLink1URL: http://www.we-online.de; ComponentLink2Description: Datasheet; ComponentLink2URL: https://katalog.we-online.com/pbs/datasheet/865090445006.pdf; Mounting Technology: SMD; Operating Temperature: -40 to +85degC; Packaging: Tape and Reel; Part Number: 865090445006; Publisher: Wurth Elektronik; Capacitance: 47uF; Diameter: 6.3mm; Length: 7.7mm; Published Date: August 2019; Rated Voltage: 25VDC; Capacitance Tolerance: +/-20%
C107#1 = 865060543005: as C154#1 on sheet 5V_Isolated_Bias; ComponentLink1Description: Manufacturer; ComponentLink1URL: http://www.we-online.de; ComponentLink2Description: Datasheet; ComponentLink2URL: https://katalog.we-online.com/pbs/datasheet/865060543005.pdf; Length: 5.5mm; Mounting Technology: SMT; Operating Temperature: -55 to +105degC; Packaging: Tape and Reel; Published Date: August 2019; Capacitance: 47uF; Diameter: 6.3mm; Part Number: 865060543005; Publisher: Wurth Elektronik; Capacitance Tolerance: +/-20%; Rated Voltage: 35VDC
D14 = SS14: Schottky Rectifier, 1.1 W, -65 to 125 degC, 2-Pin SMD, RoHS, Tape and Reel; Manufacturer: Fairchild; Configuration: SINGLE; Diode Element Material: SILICON; Power Dissipation Limit-Max (W): 1.1; Additional Feature: FREEWHEELINGDIODE; Signal Diode Type: SIGNALDIODE; Number of Elements: 1; JEDEC-95 Code: DO-214AC; Rep Pk Reverse Voltage-Max (V): 40; Package Body Material: PLASTIC/EPOXY; CAGE Code: 1HBD3,07933,59621,7D893; Peak Reflow Temperature (Cel): 260; Package Shape: RECTANGULAR; Manufacturer URL: https://www.fairchildsemi.com/; JESD-97 Code: e3; Package Reference: DO-214AC-2; RoHS Compliant: YES; Package Description: 2-Pin Surface Mount Device, Body 4.375 x 2.725 mm; Technology: SCHOTTKY; Surface Mount: YES; Datasheet URL: http://www.onlinecomponents.com/datasheet/ss14.aspx?p=11369800; Terminal Form: CBEND; Package Style: SMALLOUTLINE; Number of Terminals: 2; JESD-30 Code: R-PDSO-C2; Average Forward Current-Max (A): 1; Terminal Finish: MATTETIN; Datasheet Version: Oct-13; Terminal Position: DUAL; Package URL: https://www.fairchildsemi.com/package-drawings/DO/DO214AC.pdf; Moisture Sensitivity Level: 1; Lead Free: YES
R56 R57 = ERJ-3GEY0R00V: RES SMD 0.0OHM JUMPER 1/10W 0603; Manufacturer: Panasonic Electronic Components; Factory Stock: 0; Unit Price (USD): 0.00352; @ qty: 1500; Minimum Quantity: 1; Power (Watts): 0.1W, 1/10W; Part Number: ERJ-3GEY0R00V; Datasheets: http://industrial.panasonic.com/www-cgi/jvcr13pz.cgi?E+PZ+3+AOA0001+ERJ3GEY0R00V+7+WW; Image: //media.digikey.com/Photos/Panasonic%20Photos/MFG_ERJ-P6W%20Series.jpg; Digi-Key Part Number: P0.0GCT-ND; Quantity Available: 4813372; Packaging: Cut Tape (CT); Series: ERJ; Part Status: Active; Value: 0.0; Tolerance: Jumper; Composition: Thick Film; Features: Automotive AEC-Q200; Temperature Coefficient: -; Operating Temperature: -55°C ~ 155°C; Package / Case: 0603 (1608 Metric); Supplier Device Package: 0603; Size / Dimension: 0.063" L x 0.031" W (1.60mm x 0.80mm); Height - Seated (Max): 0.022" (0.55mm); Number of Terminations: 2; Failure Rate: -
R58-R60 = ERJ-1TNF6192U: RES SMD 61.9K OHM 1% 1W 2512; Manufacturer: Panasonic Electronic Components; Factory Stock: 0; Unit Price (USD): 0.14799; @ qty: 1500; Minimum Quantity: 1; Temperature Coefficient: ±100ppm/°C; Part Number: ERJ-1TNF6192U; Datasheets: http://industrial.panasonic.com/www-cgi/jvcr13pz.cgi?E+PZ+3+AOA0002+ERJ1TNF6192U+7+WW; Image: //media.digikey.com/Renders/Panasonic%20Renders/ERJ-2512%20Pkg.jpg; Digi-Key Part Number: PT61.9KAFCT-ND; Quantity Available: 2628; Packaging: Cut Tape (CT); Series: ERJ; Part Status: Active; Value: 61.9k; Tolerance: ±1%; Power (Watts): 1W; Composition: Thick Film; Features: Automotive AEC-Q200; Operating Temperature: -55°C ~ 155°C; Package / Case: 2512 (6432 Metric); Supplier Device Package: 2512; Size / Dimension: 0.252" L x 0.126" W (6.40mm x 3.20mm); Height - Seated (Max): 0.028" (0.70mm); Number of Terminations: 2; Failure Rate: -
R61 = ERJ-8ENF2701V: RES SMD 2.7K OHM 1% 1/4W 1206; Manufacturer: Panasonic Electronic Components; Factory Stock: 0; Unit Price (USD): 0.00933; @ qty: 1500; Minimum Quantity: 1; Power (Watts): 0.25W, 1/4W; Temperature Coefficient: ±100ppm/°C; Part Number: ERJ-8ENF2701V; Datasheets: http://industrial.panasonic.com/www-cgi/jvcr13pz.cgi?E+PZ+3+AOA0002+ERJ8ENF2701V+7+WW; Image: //media.digikey.com/Renders/Panasonic%20Renders/ERJ-1206%20Pkg.jpg; Digi-Key Part Number: P2.70KFCT-ND; Quantity Available: 47214; Packaging: Cut Tape (CT); Series: ERJ; Part Status: Active; Value: 2.7k; Tolerance: ±1%; Composition: Thick Film; Features: Automotive AEC-Q200; Operating Temperature: -55°C ~ 155°C; Package / Case: 1206 (3216 Metric); Supplier Device Package: 1206; Size / Dimension: 0.126" L x 0.063" W (3.20mm x 1.60mm); Height - Seated (Max): 0.028" (0.70mm); Number of Terminations: 2; Failure Rate: -
SB41-SB44 SB45#1 = Solder Bridge: Circuit Breaker; Published: 24-Mar-1999; Revision: July-2002: Re-released for DXP Platform.; Publisher: Altium Limited
U6 = ACS758: Current Sensor 50A 1 Channel Hall Effect, Open Loop Unidirectional 5-CB Formed Leads, PFF; MF: Allegro MicroSystems LLC; Package: 5-CB-5 Allegro MicroSystems LLC; MP: ACS758; Availability: Unavailable; Price: None; Value: *; SnapEDA_Link: https://www.snapeda.com/parts/ACS758/Allegro%20MicroSystems%20LLC/view-part/226237/?ref=snap
U7 = CMP-0055-00741-3: Low Power Quad Operational Amplifier, 14-pin Narrow SOIC; Manufacturer: Texas Instruments; PowerWise: N; CompType: Amplifiers; PackageTopMarking: NSUZXYTTE#*LM324M; Package Reference: D0014A; ComponentLink1URL: http://www.ti.com/general/docs/lit/getliterature.tsp?genericPartNumber=LM324-N&fileType=pdf; PinCount: 14; PackageDescription: Molded Package S.O., .150in Wide, 14 Lead; Code_JEDEC: MS-012AB; Code_IPC: SOIC127P600-14; ComponentLink1Description: Datasheet URL; RoHS: N

## Sheet Output Current Sense.SchDoc
size A3
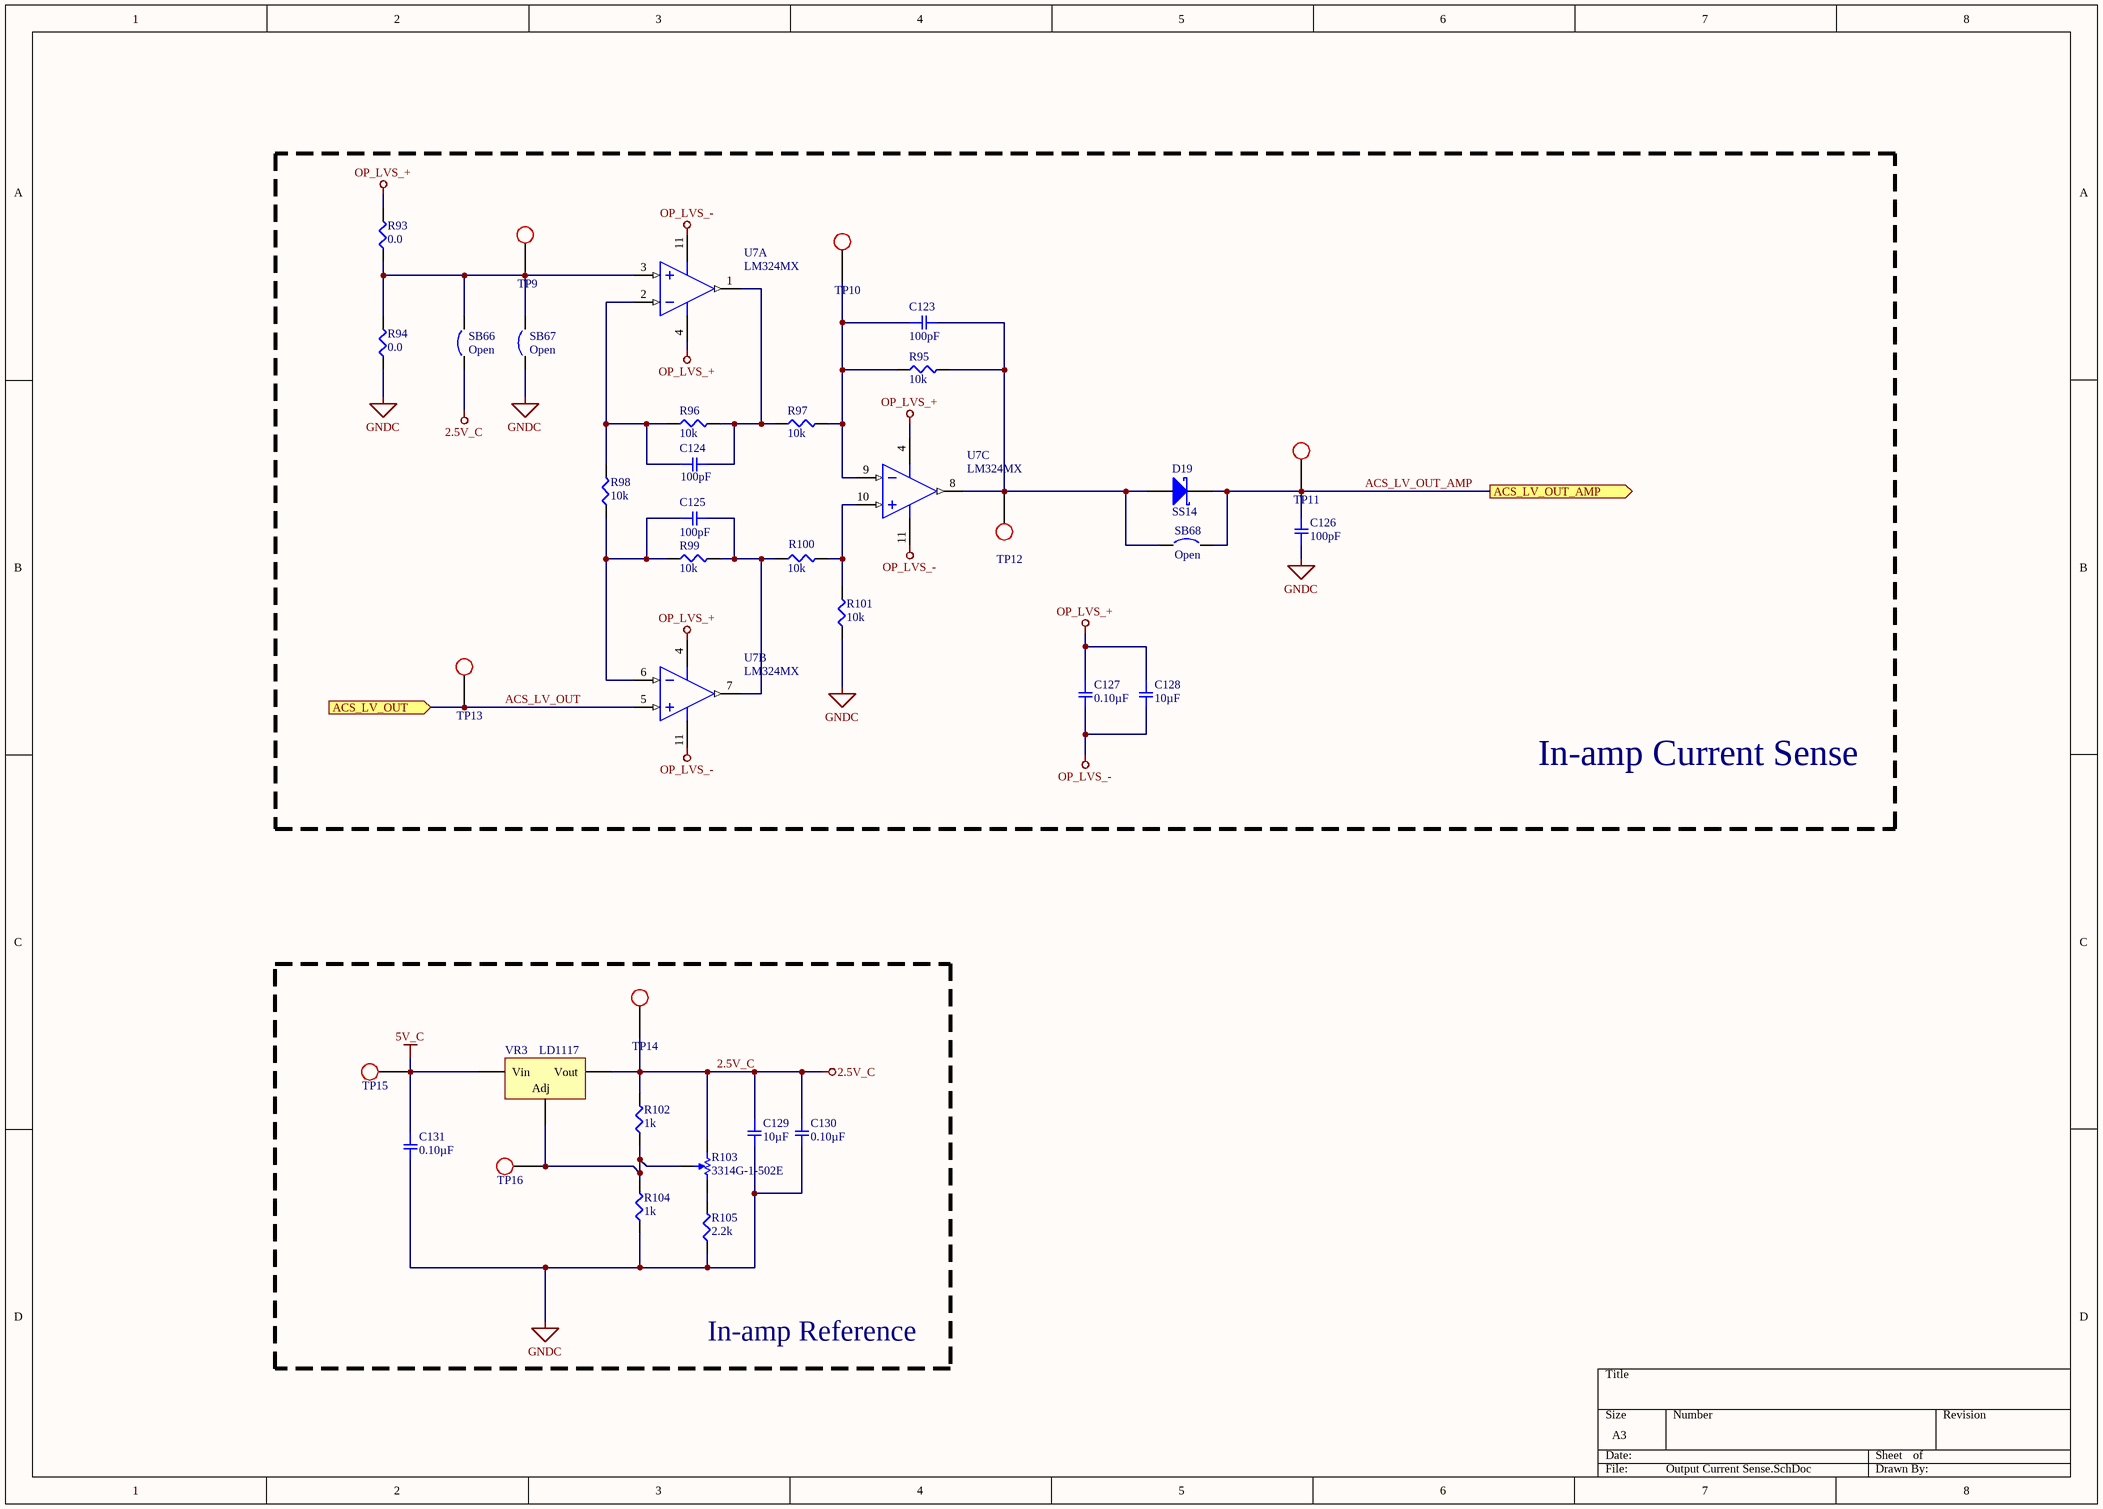
[diagram p11: Output Current Sense.SchDoc]

### Parts
(Parts that share a designator on the sheet are numbered #1, #2 ... from top to bottom, then left to right.)
C123  100pF  [SMD-0603C]
C124  100pF  [SMD-0603C]
C125  100pF  [SMD-0603C]
C126  100pF  [SMD-0603C]
C127  0.10µF  [SMD-0805C]
C128  10µF  [SMD-0805C]
C129  10µF  [SMD-0805C]
C130  0.10µF  [SMD-0805C]
C131  0.10µF  [SMD-0805C]
D19  SS14  [DIOM4226X22N]
R93  0.0  [SMD-0603-RES]
R94  0.0  [SMD-0603-RES]
R95  10k  [SMD-0603-RES]
R96  10k  [SMD-0603-RES]
R97  10k  [SMD-0603-RES]
R98  10k  [SMD-0603-RES]
R99  10k  [SMD-0603-RES]
R100  10k  [SMD-0603-RES]
R101  10k  [SMD-0603-RES]
R102  1k  [SMD-0603-RES]
R103  3314G-1-502E  [BOUR-3314G-1_V]
R104  1k  [SMD-0603-RES]
R105  2.2k  [SMD-0603-RES]
SB66#2  Open  [0805-Solder Bridge]  (no BOM)
SB67#2  Open  [0805-Solder Bridge]  (no BOM)
SB68#2  Open  [0805-Solder Bridge]  (no BOM)
TP9  Test Point  [Test_point_THT]  (value not drawn)  (no BOM)
TP10  Test Point  [Test_point_THT]  (value not drawn)  (no BOM)
TP11  Test Point  [Test_point_THT]  (value not drawn)  (no BOM)
TP12  Test Point  [Test_point_THT]  (value not drawn)  (no BOM)
TP13  Test Point  [Test_point_THT]  (value not drawn)  (no BOM)
TP14  Test Point  [Test_point_THT]  (value not drawn)  (no BOM)
TP15  Test Point  [Test_point_THT]  (value not drawn)  (no BOM)
TP16  Test Point  [Test_point_THT]  (value not drawn)  (no BOM)
U7  LM324MX  [D0014A_L]  (parts A,B,C of 4)
VR3  LD1117  [SOT230P700X180-4N]

### Blocks framed on the sheet
In-amp Current Sense: C123-C128 D19 R93-R101 SB66#2 SB67#2 SB68#2 TP9-TP13 U7
In-amp Reference: C129-C131 R102-R105 TP14-TP16 VR3

### Ports
ACS_LV_OUT (in), ACS_LV_OUT_AMP (out)

### Nets
2.5V_C: C129.1 C130.1 R102.2 R103.1 SB66#2.1 TP14.1 VR3.2(Vout)
5V_C: C131.1 TP15.1 VR3.3(Vin)
GNDC: C126.1 C129.2 C130.2 C131.2 R94.1 R101.1 R104.1 R105.1 SB67#2.1  [project net GND_LV]
OP_LVS_+: C127.1 C128.1 R93.2 U7.4(V+)
OP_LVS_-: C127.2 C128.2 U7.11(GND)
ACS_LV_OUT: TP13.1 U7.5(IN2+) ; port ACS_LV_OUT
ACS_LV_OUT_AMP: C126.2 D19.1(K) SB68#2.2 TP11.1 ; port ACS_LV_OUT_AMP
NetC123_1: C123.1 R95.1 R97.2 TP10.1 U7.9(IN3-)
NetC123_2: C123.2 D19.2(A) R95.2 SB68#2.1 TP12.1 U7.8(OUT3)
NetC124_1: C124.1 R96.1 R98.2 U7.2(IN1-)
NetC124_2: C124.2 R96.2 R97.1 U7.1(OUT1)
NetC125_1: C125.1 R98.1 R99.1 U7.6(IN2-)
NetC125_2: C125.2 R99.2 R100.1 U7.7(OUT2)
NetR93_1: R93.1 R94.2 SB66#2.2 SB67#2.2 TP9.1 U7.3(IN1+)
NetR100_2: R100.2 R101.2 U7.10(IN3+)
NetR102_1: R102.1 R103.2 R104.2 TP16.1 VR3.1(Adj)
NetR103_3: R103.3 R105.2

### Library data of the parts
C123-C126 = GCM1885C1H101JA16D: as C102 on sheet Output Sense Network; Datasheets: http://www.murata.com/~/media/webrenewal/support/library/catalog/products/capacitor/mlcc/c03e.ashx; Image: //media.digikey.com/Renders/Murata%20Renders/0603%28GCM188%29.jpg; Digi-Key Part Number: 490-4767-1-ND; Part Number: GCM1885C1H101JA16D; Quantity Available: 85695; @ qty: 0; Packaging: Cut Tape (CT); Series: GCM; Part Status: Active; Value: 100pF; Voltage: 50V; Operating Temperature: -55°C ~ 125°C; Features: -; Ratings: AEC-Q200; Applications: Automotive; Mounting Type: Surface Mount, MLCC; Package / Case: 0603 (1608 Metric); Size / Dimension: 0.063" L x 0.031" W (1.60mm x 0.80mm); Height - Seated (Max): -; Thickness (Max): 0.035" (0.90mm); Lead Spacing: -; Lead Style: -
C127 C130 C131 = GCD21BR71H104KA01L: as C151#1 on sheet 5V_Isolated_Bias; Datasheets: http://www.murata.com/~/media/webrenewal/support/library/catalog/products/capacitor/mlcc/c03e.ashx; Image: //media.digikey.com/Renders/Murata%20Renders/0805%28GxM6%29.jpg; Digi-Key Part Number: 490-11955-1-ND; Part Number: GCD21BR71H104KA01L; Quantity Available: 157; @ qty: 0; Packaging: Cut Tape (CT); Series: GCD; Part Status: Active; Value: 0.10µF; Voltage: 50V; Temperature Coefficient: X7R; Operating Temperature: -55°C ~ 125°C; Features: -; Ratings: AEC-Q200; Applications: Automotive; Mounting Type: Surface Mount, MLCC; Package / Case: 0805 (2012 Metric); Size / Dimension: 0.079" L x 0.049" W (2.00mm x 1.25mm); Height - Seated (Max): -; Thickness (Max): 0.049" (1.25mm); Lead Spacing: -; Lead Style: -
C128 C129 = GCJ21BR71A106KE01L: as C100 on sheet Output Sense Network; Datasheets: http://www.murata.com/~/media/webrenewal/support/library/catalog/products/capacitor/mlcc/c03e.ashx; Image: //media.digikey.com/Renders/Murata%20Renders/0805%20(2012%20Metric)%20.85mm.jpg; Digi-Key Part Number: 490-12646-1-ND; Part Number: GCJ21BR71A106KE01L; Quantity Available: 2702; @ qty: 0; Packaging: Cut Tape (CT); Series: GCJ; Part Status: Active; Value: 10µF; Voltage: 10V; Temperature Coefficient: X7R; Operating Temperature: -55°C ~ 125°C; Features: Soft Termination; Ratings: AEC-Q200; Applications: Automotive, Boardflex Sensitive; Mounting Type: Surface Mount, MLCC; Package / Case: 0805 (2012 Metric); Size / Dimension: 0.079" L x 0.049" W (2.00mm x 1.25mm); Height - Seated (Max): -; Thickness (Max): 0.057" (1.45mm); Lead Spacing: -; Lead Style: -
D19 = SS14: as D14 on sheet Output Sense Network; Peak Reflow Temperature (Cel): 260; Package Shape: RECTANGULAR; Manufacturer URL: https://www.fairchildsemi.com/; JESD-97 Code: e3; Package Reference: DO-214AC-2; RoHS Compliant: YES; Package Description: 2-Pin Surface Mount Device, Body 4.375 x 2.725 mm; Technology: SCHOTTKY; Surface Mount: YES; Datasheet URL: http://www.onlinecomponents.com/datasheet/ss14.aspx?p=11369800; Terminal Form: CBEND; Package Style: SMALLOUTLINE; Number of Terminals: 2; JESD-30 Code: R-PDSO-C2; Average Forward Current-Max (A): 1; Terminal Finish: MATTETIN; Datasheet Version: Oct-13; Terminal Position: DUAL; Package URL: https://www.fairchildsemi.com/package-drawings/DO/DO214AC.pdf; Moisture Sensitivity Level: 1; Lead Free: YES
R93 R94 = ERJ-3GEY0R00V: as R56 on sheet Output Sense Network; Part Number: ERJ-3GEY0R00V; Datasheets: http://industrial.panasonic.com/www-cgi/jvcr13pz.cgi?E+PZ+3+AOA0001+ERJ3GEY0R00V+7+WW; Image: //media.digikey.com/Photos/Panasonic%20Photos/MFG_ERJ-P6W%20Series.jpg; Digi-Key Part Number: P0.0GCT-ND; Quantity Available: 4813372; Packaging: Cut Tape (CT); Series: ERJ; Part Status: Active; Value: 0.0; Tolerance: Jumper; Composition: Thick Film; Features: Automotive AEC-Q200; Temperature Coefficient: -; Operating Temperature: -55°C ~ 155°C; Package / Case: 0603 (1608 Metric); Supplier Device Package: 0603; Size / Dimension: 0.063" L x 0.031" W (1.60mm x 0.80mm); Height - Seated (Max): 0.022" (0.55mm); Number of Terminations: 2; Failure Rate: -
R95-R101 = ERJ-3EKF1002V: RES SMD 10K OHM 1% 1/10W 0603; Manufacturer: Panasonic Electronic Components; Factory Stock: 0; Unit Price (USD): 0.00379; @ qty: 1500; Minimum Quantity: 1; Power (Watts): 0.1W, 1/10W; Temperature Coefficient: ±100ppm/°C; Part Number: ERJ-3EKF1002V; Datasheets: http://industrial.panasonic.com/www-cgi/jvcr13pz.cgi?E+PZ+3+AOA0002+ERJ3EKF1002V+7+WW; Image: //media.digikey.com/Photos/Panasonic%20Photos/MFG_ERJ-P6W%20Series.jpg; Digi-Key Part Number: P10.0KHCT-ND; Quantity Available: 6703141; Packaging: Cut Tape (CT); Series: ERJ; Part Status: Active; Value: 10k; Tolerance: ±1%; Composition: Thick Film; Features: Automotive AEC-Q200; Operating Temperature: -55°C ~ 155°C; Package / Case: 0603 (1608 Metric); Supplier Device Package: 0603; Size / Dimension: 0.063" L x 0.031" W (1.60mm x 0.80mm); Height - Seated (Max): 0.022" (0.55mm); Number of Terminations: 2; Failure Rate: -
R102 R104 = ERJ-3EKF1001V: RES SMD 1K OHM 1% 1/10W 0603; Manufacturer: Panasonic Electronic Components; Factory Stock: 0; Unit Price (USD): 0.00379; @ qty: 1500; Minimum Quantity: 1; Power (Watts): 0.1W, 1/10W; Temperature Coefficient: ±100ppm/°C; Part Number: ERJ-3EKF1001V; Datasheets: http://industrial.panasonic.com/www-cgi/jvcr13pz.cgi?E+PZ+3+AOA0002+ERJ3EKF1001V+7+WW; Image: //media.digikey.com/Photos/Panasonic%20Photos/MFG_ERJ-P6W%20Series.jpg; Digi-Key Part Number: P1.00KHCT-ND; Quantity Available: 5218845; Packaging: Cut Tape (CT); Series: ERJ; Part Status: Active; Value: 1k; Tolerance: ±1%; Composition: Thick Film; Features: Automotive AEC-Q200; Operating Temperature: -55°C ~ 155°C; Package / Case: 0603 (1608 Metric); Supplier Device Package: 0603; Size / Dimension: 0.063" L x 0.031" W (1.60mm x 0.80mm); Height - Seated (Max): 0.022" (0.55mm); Number of Terminations: 2; Failure Rate: -
R103 = CMP-2000-05589-1: 4 mm Square Trimpot(R) Trimming Potentiometer, 5 KOhm, +/- 20%, 0.25 W, -55 to 125 degC, 3-Pin SMD, RoHS, Tape and Reel; Manufacturer: Bourns; Power: 250; Angle of rotation: 240°; Dielectric strength: 500; Resistance: 5; Curve: linear; Package Description: 3-Pin Surface Mount Device, Body 4.5 x 4.5 mm, Pitch 1.15 mm; Package Reference: 3314G-1; Mounting Technology: SurfaceMount; Datasheet URL: http://www.bourns.com/docs/Product-Datasheets/3314.pdf; Datasheet Version: 05/2016; Tolerance: ±20%; Manufacturer URL: http://www.bourns.com/; Temperature range: -55...+125°C; Package: GullWing
R105 = ERJ-3EKF2201V: RES SMD 2.2K OHM 1% 1/10W 0603; Manufacturer: Panasonic Electronic Components; Factory Stock: 0; Unit Price (USD): 0.00379; @ qty: 1500; Minimum Quantity: 1; Power (Watts): 0.1W, 1/10W; Temperature Coefficient: ±100ppm/°C; Part Number: ERJ-3EKF2201V; Datasheets: http://industrial.panasonic.com/www-cgi/jvcr13pz.cgi?E+PZ+3+AOA0002+ERJ3EKF2201V+7+WW; Image: //media.digikey.com/Photos/Panasonic%20Photos/MFG_ERJ-P6W%20Series.jpg; Digi-Key Part Number: P2.20KHCT-ND; Quantity Available: 370956; Packaging: Cut Tape (CT); Series: ERJ; Part Status: Active; Value: 2.2k; Tolerance: ±1%; Composition: Thick Film; Features: Automotive AEC-Q200; Operating Temperature: -55°C ~ 155°C; Package / Case: 0603 (1608 Metric); Supplier Device Package: 0603; Size / Dimension: 0.063" L x 0.031" W (1.60mm x 0.80mm); Height - Seated (Max): 0.022" (0.55mm); Number of Terminations: 2; Failure Rate: -
SB66#2 SB67#2 SB68#2 = Solder Bridge: Circuit Breaker; Published: 24-Mar-1999; Revision: July-2002: Re-released for DXP Platform.; Publisher: Altium Limited
TP9-TP16 = Test Point: TP
U7 = CMP-0055-00741-3: as U7 on sheet Output Sense Network; Package Reference: D0014A; ComponentLink1URL: http://www.ti.com/general/docs/lit/getliterature.tsp?genericPartNumber=LM324-N&fileType=pdf; PinCount: 14; PackageDescription: Molded Package S.O., .150in Wide, 14 Lead; Code_JEDEC: MS-012AB; Code_IPC: SOIC127P600-14; ComponentLink1Description: Datasheet URL; RoHS: N
VR3 = LD117-Adj: Voltage Regulator; Published: 24-Mar-1999; LatestRevisionDate: 29-May-2009; LatestRevisionNote: IPC-7351 Footprint Added.; PackageReference: D2PAK; Publisher: Altium Limited; PackageDescription: 3-Pin Transistor Outline Package 2.54 mm Pitch, 15.1 mm Lead Span